# EAGLE design GamePad (EAGLE 9.2.2)
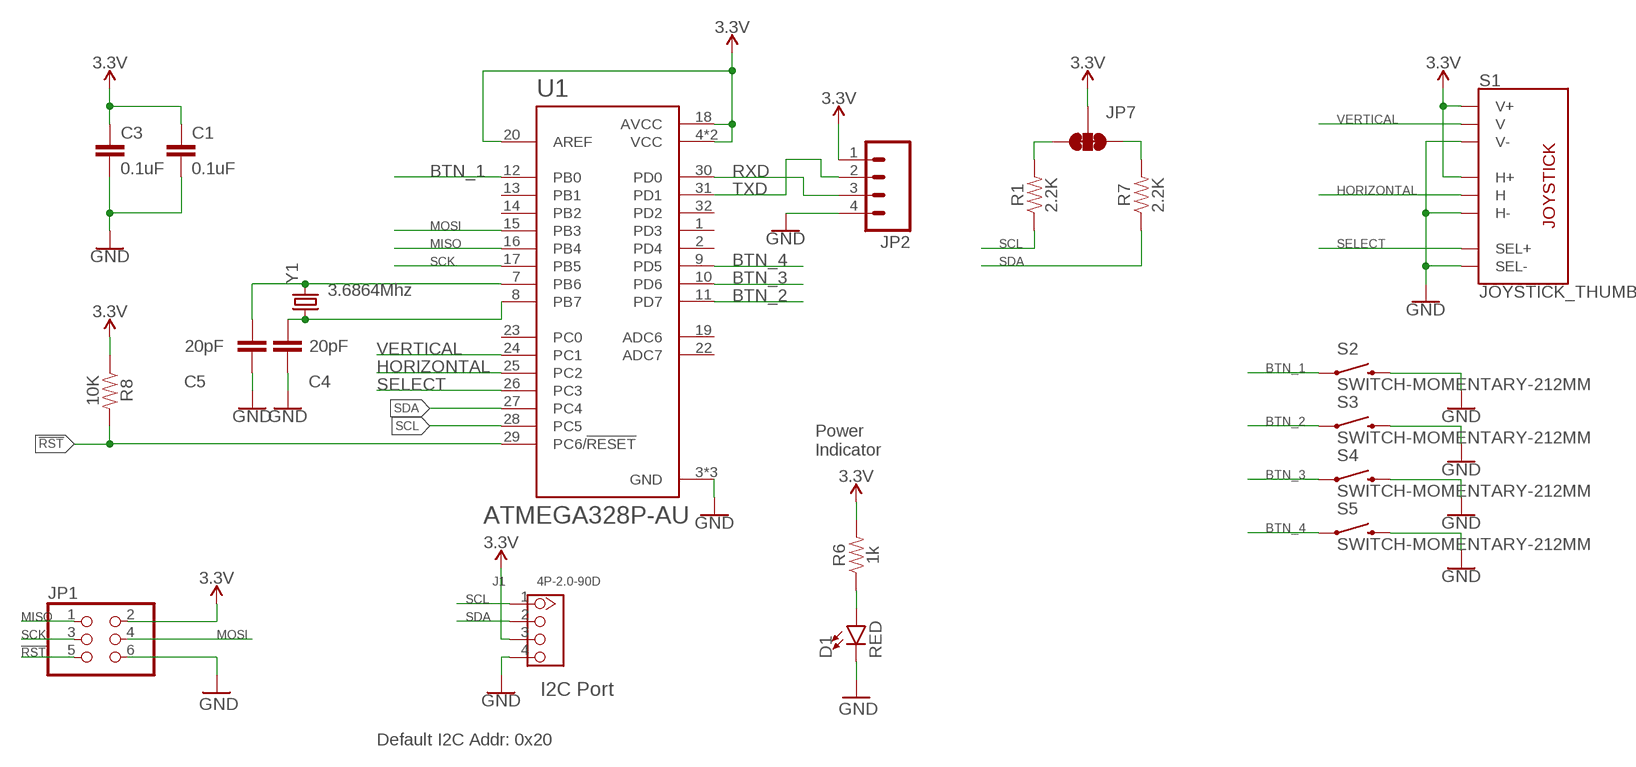
[diagram p0: schematic, sheet 1]

## Parts
C1  0.1uF  CAP0603-CAP  [0603-CAP]
C3  0.1uF  CAP0603-CAP  [0603-CAP]
C4  20pF  CAP0603-CAP  [0603-CAP]
C5  20pF  CAP0603-CAP  [0603-CAP]
D1  RED  LED-RED0603  [LED-0603]
J1  4P-2.0-90D  GROVE-CONNECTOR-DIP-90D(4P-2.0)  [HW4-2.0-90D]
JP1  PINHD-2X3  [2X03]
JP2  M04LOCK  [1X04_LOCK]
JP7  JUMPER-SMT_3_2-NC_TRACE_NO-SILK  [SMT-JUMPER_3_2-NC_TRACE_NO-SILK]
R1  2.2K  4.7KOHM-0603-1/10W-1%  [0603]
R6  1k  1KOHM-0603-1/10W-1%  [0603]
R7  2.2K  4.7KOHM-0603-1/10W-1%  [0603]
R8  10K  330OHM-0603-1/10W-1%  [0603]
S1  JOYSTICK_THUMB  [JOYSTICK]
S2  SWITCH-MOMENTARY-212MM  [TACTILE-PTH-12MM]
S3  SWITCH-MOMENTARY-212MM  [TACTILE-PTH-12MM]
S4  SWITCH-MOMENTARY-212MM  [TACTILE-PTH-12MM]
S5  SWITCH-MOMENTARY-212MM  [TACTILE-PTH-12MM]
U1  ATMEGA328P-AU  [QFP80P900X900X120-32N]
Y1  3.6864Mhz  CRYSTALSMD  [HC49UP]

## Nets
3.3V: C1.1 C3.1 J1.3 JP1.2 JP2.1 JP7.2 R6.2 R8.1 S1.H1(H+) S1.V1(V+) U1.4(VCC) U1.6(VCC) U1.18(AVCC) U1.20(AREF)
!RST: JP1.5 R8.2 U1.29(PC6/!RESET)
BTN_1: S2.1 U1.12(PB0)
BTN_2: S3.1 U1.11(PD7)
BTN_3: S4.1 U1.10(PD6)
BTN_4: S5.1 U1.9(PD5)
GND: C1.2 C3.2 C4.1 C5.1 D1.C J1.4 JP1.6 JP2.4 S1.B2A(SEL-) S1.H3(H-) S1.V3(V-) S2.3 S3.3 S4.3 S5.3 U1.3(GND) U1.5(GND) U1.21(GND)
HORIZONTAL: S1.H2(H) U1.25(PC2)
MISO: JP1.1 U1.16(PB4)
MOSI: JP1.4 U1.15(PB3)
N$1: D1.A R6.1
N$2: JP7.1 R7.2
N$3: JP7.3 R1.2
N$4: C5.2 U1.7(PB6) Y1.2
N$5: C4.2 U1.8(PB7) Y1.1
RXD: JP2.3 U1.30(PD0)
SCK: JP1.3 U1.17(PB5)
SCL: J1.1 R1.1 U1.28(PC5)
SDA: J1.2 R7.1 U1.27(PC4)
SELECT: S1.B1A(SEL+) U1.26(PC3)
TXD: JP2.2 U1.31(PD1)
VERTICAL: S1.V2(V) U1.24(PC1)
Unconnected: U1.1(PD3) U1.2(PD4) U1.13(PB1) U1.14(PB2) U1.19(ADC6) U1.22(ADC7) U1.23(PC0) U1.32(PD2)

## Notes on the sheet
- Power
  Indicator
- I2C Port
- Default I2C Addr: 0x20

## Library data of the parts
C1 C3-C5 = SparkFun:CAP: Capacitor Standard 0603 ceramic capacitor, and 0.1" leaded capacitor.
D1 = SparkFun-LED:LED-RED: Red SMD LED Used in manufacturing of most products at SparkFun Packages: 0603 - SMD 0603 package [Product Link] <http://docs.avagotech.com/docs/AV02-0551EN> 0603 SMART - SMD 0603 SMART package ( more efficient and expensive)[Product Link] <http://www.osram-os.com/Graphics/XPic2/00077099_0.pdf> 1206 - SMD1206 package [Product Link] <https://www.sparkfun.com/datasheets/DevTools/LilyPad/Q150OVS4.pdff> SparkFun Products: Pro Mini 328 -5V <https://www.sparkfun.com/products/821> RedBoard <https://www.sparkfun.com/products/12757> IOIO-OTG <https://www.sparkfun.com/products/13613>; PROD_ID: DIO-00819
J1 = Seeed-Connector -2016:GROVE-CONNECTOR-DIP-90D(4P-2.0): 320110034
JP1 = SparkFun:PINHD-2X3: PIN HEADER
JP2 = SparkFun:M04: Header 4 Standard 4-pin 0.1" header. Use with straight break away headers (SKU : PRT-00116), right angle break away headers (PRT-00553), swiss pins (PRT-00743), machine pins (PRT-00117), and female headers (PRT-00115). Molex polarized connector foot print use with SKU : PRT-08231 with associated crimp pins and housings. 1MM SMD Version SKU: PRT-10208
JP7 = SparkFun-Jumpers:JUMPER-SMT_3_2-NC_TRACE: Normally closed trace jumper (2 of 2 connections) This jumper has a trace between all three pads so they are normally closed (NC). Use a razor knife to open the connection(s). For best results follow the IPC guidelines for cutting traces: Cutout at least 0.063 mm (0.005 in). Remove all loose material to clean up the cut area. Seal the cut with an approved epoxy. Reapply solder to reclose the connection(s).
R1 R7 = SparkFun-Resistors:4.7KOHM: 4.7kΩ resistor A resistor is a passive two-terminal electrical component that implements electrical resistance as a circuit element. Resistors act to reduce current flow, and, at the same time, act to lower voltage levels within circuits. - Wikipedia; PROD_ID: RES-07857; VALUE: 4.7k
R6 = SparkFun-Resistors:1KOHM: 1kΩ resistor A resistor is a passive two-terminal electrical component that implements electrical resistance as a circuit element. Resistors act to reduce current flow, and, at the same time, act to lower voltage levels within circuits. - Wikipedia; PROD_ID: RES-07856
R8 = SparkFun-Resistors:330OHM: 330Ω resistor A resistor is a passive two-terminal electrical component that implements electrical resistance as a circuit element. Resistors act to reduce current flow, and, at the same time, act to lower voltage levels within circuits. - Wikipedia; PROD_ID: RES-00818; VALUE: 330
S1 = SparkFun-Switches:JOYSTICK_THUMB: Analog Thumb Joystick This is a joystick very similar to the ‘analog’ joysticks on PS2 (PlayStation 2) controllers. Directional movements are simply two potentiometers - one for each axis. Pots are ~10k each. This joystick also has a select button that is actuated when the joystick is pressed down. SparkFun Products Thumb Joystick <https://www.sparkfun.com/products/9032> (COM-09032) SparkFun Thumb Joystick Breakout <https://www.sparkfun.com/products/9110> (BOB-09110) SparkFun Joystick Shield Kit <https://www.sparkfun.com/products/9760> (DEV-09760); PROD_ID: COMP-09744; SF_SKU: COM-09032
S2-S5 = SparkFun:SWITCH-MOMENTARY-2
U1 = ATMEGA328P-AU:ATMEGA328P-AU: ATmega Series 20 MHz 32 KB Flash 2 KB SRAM 8-Bit Microcontroller - TQFP-32; AVAILABILITY: Unavailable; DESCRIPTION: Microcontroller Mcu, 8 Bit, Atmega, 20mhz, Tqfp-32; MF: Microchip; MP: ATMEGA328P-AU; PACKAGE: TQFP-32 Microchip; PRICE: None
Y1 = SparkFun:CRYSTAL: Crystals Various standard crystals. Proven footprints. Spark Fun Electronics SKU : COM-00534

## Board
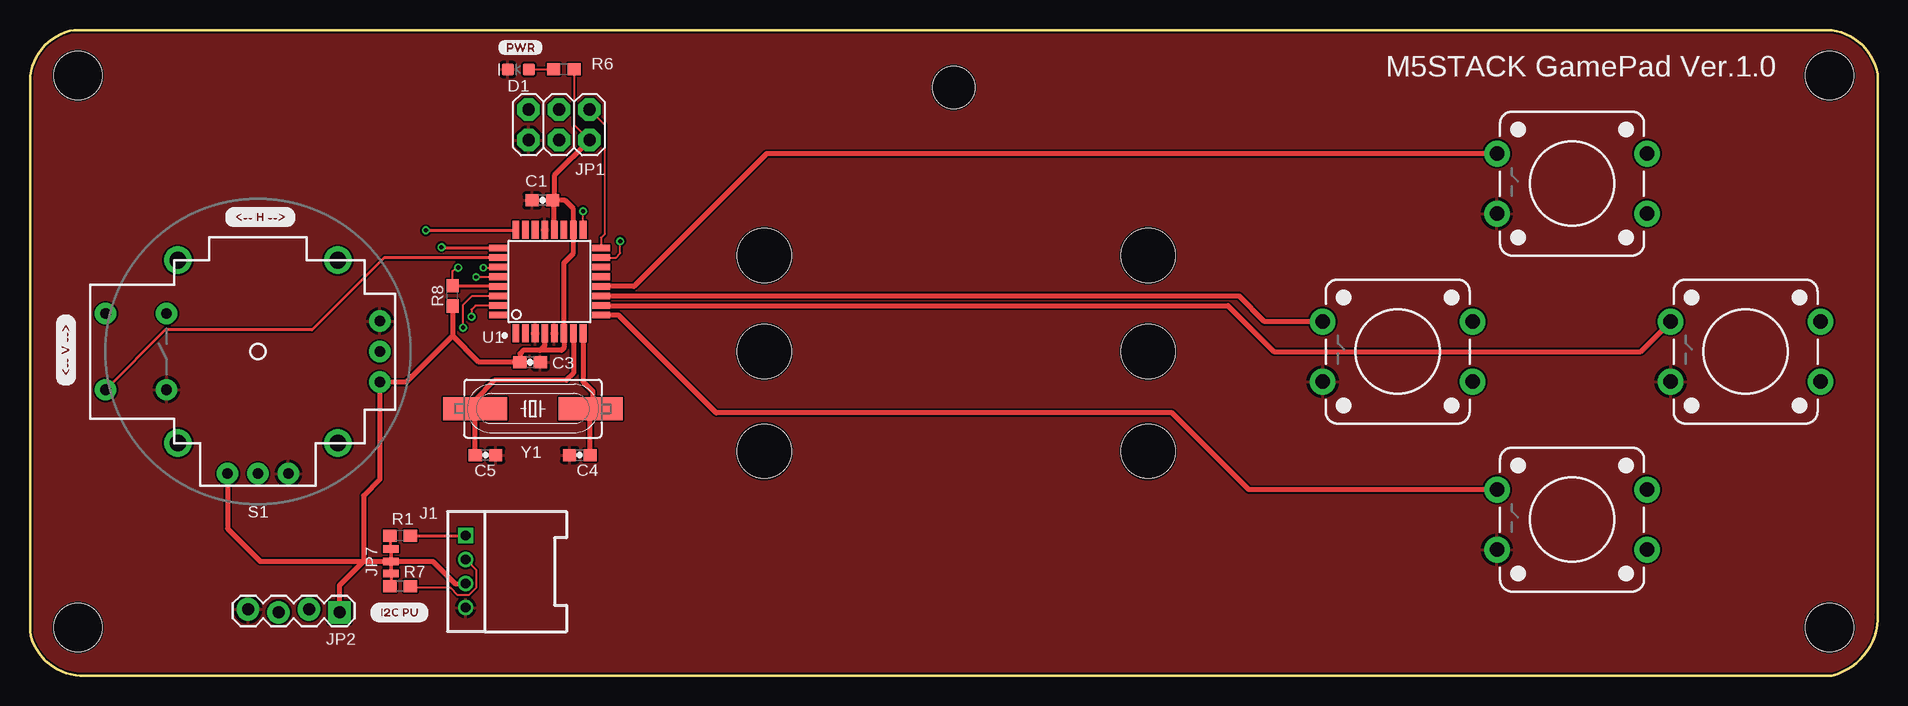
[diagram p1: board, top side]
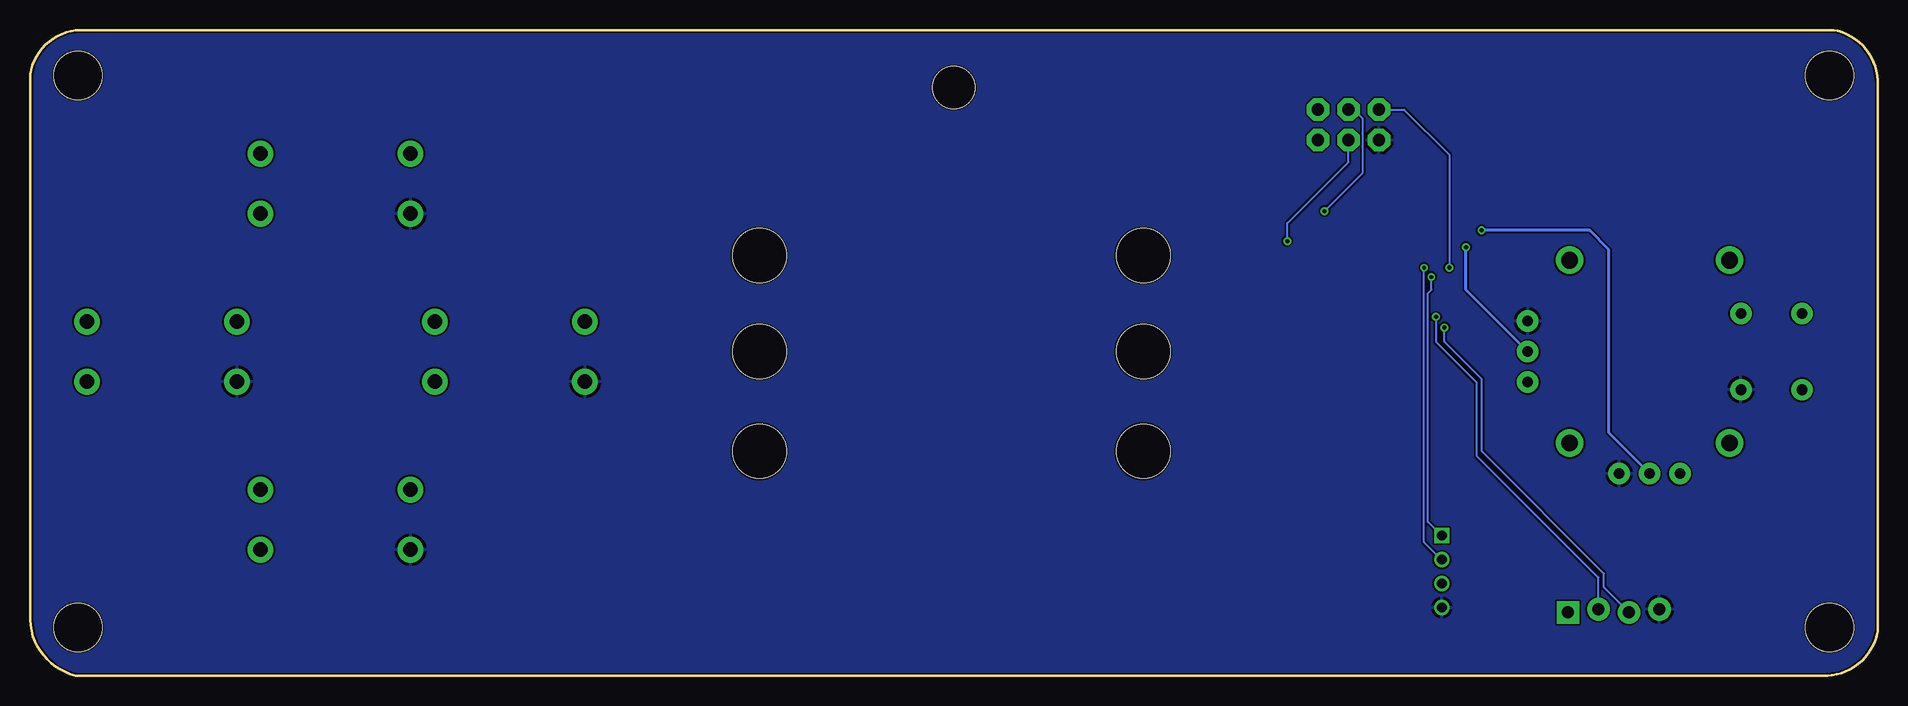
[diagram p2: board, bottom side, seen from below]

Size 154 x 53.8 mm. Coordinates in mm from the lower left corner, seen from the top.
Outline: 0,49.6 0,3.7 arc79 4.2,0 150.2,0 arc79 154,5.1 154,50.1 arc79 149.8,53.8 3.7,53.8 arc79 0,49.6
Copper layers (1*16): Top 0.035mm / dielectric 1.5mm / Bottom 0.035mm
Design rules "SparkFun-2-layer-PCBWay-LIMIT": minimum track width 6mil, minimum drill 0.3mm, track to track 6mil, track to pad 6mil, pad to pad 6mil, via to via 6mil, smd to smd 6mil, copper to edge 6mil, drill to drill 6mil, minimum pad ring 6mil, minimum via ring 6mil, stop-mask expansion 4mil, vias tented up to drill 25mil, thermal gap 10mil
Holes 4.5 mm at 61.2,35 61.2,27 61.2,18.7 93.2,35 93.2,27 93.2,18.7
Holes 4 mm at 4,50 4,4 150,50 150,4
Holes 3.5 mm at 77,49

### Footprints (pad centres in the part's own frame; a part is rotated, then mirrored left to right if it is on the bottom)
0603-CAP = smd 1.1 x 1: 1 -0.85,0; 2 0.85,0
LED-0603 = smd 1 x 1: A -0.877,0; C 0.877,0
HW4-2.0-90D = drill 0.8 pad 1.27 square: 1 -3,0 | drill 0.8 pad 1.27: 2 -1,0; 3 1,0; 4 3,0
2X03 = drill 1.016 pad 1.88 octagon: 1 -2.54,-1.27; 2 -2.54,1.27; 3 0,-1.27; 4 0,1.27; 5 2.54,-1.27; 6 2.54,1.27
1X04_LOCK = drill 1.016 pad 1.88 square: 1 0,0.127 | drill 1.016 pad 1.88: 2 2.54,-0.127; 3 5.08,0.127; 4 7.62,-0.127
SMT-JUMPER_3_2-NC_TRACE_NO-SILK = smd 0.635 x 1.27: 1 -1.016,0; 2 0,0; 3 1.016,0
0603 = smd 1.1 x 1: 1 -0.85,0; 2 0.85,0
JOYSTICK = drill 0.9 pad 1.778: B1A -3.175,12.7; B1B 3.175,12.7; B2A -3.175,7.62; B2B 3.175,7.62 | drill 0.889 pad 1.778: H1 -2.54,-10.16; H2 0,-10.16; H3 2.54,-10.16; V1 -10.16,2.54; V2 -10.16,0; V3 -10.16,-2.54 | drill 1.397 pad 2.286: MOUNT1 -7.62,6.668; MOUNT2 -7.62,-6.668; MOUNT3 7.62,-6.668; MOUNT4 7.62,6.668
TACTILE-PTH-12MM = drill 1.2 pad 2.159: 1 6.25,-2.5; 2 -6.25,-2.5; 3 6.25,2.5; 4 -6.25,2.5
QFP80P900X900X120-32N = smd 1.5 x 0.55: 1 -4.3,2.8; 2 -4.3,2; 3 -4.3,1.2; 4 -4.3,0.4; 5 -4.3,-0.4; 6 -4.3,-1.2; 7 -4.3,-2; 8 -4.3,-2.8; 17 4.3,-2.8; 18 4.3,-2; 19 4.3,-1.2; 20 4.3,-0.4; 21 4.3,0.4; 22 4.3,1.2; 23 4.3,2; 24 4.3,2.8 | smd 0.55 x 1.5: 9 -2.8,-4.3; 10 -2,-4.3; 11 -1.2,-4.3; 12 -0.4,-4.3; 13 0.4,-4.3; 14 1.2,-4.3; 15 2,-4.3; 16 2.8,-4.3; 25 2.8,4.3; 26 2,4.3; 27 1.2,4.3; 28 0.4,4.3; 29 -0.4,4.3; 30 -1.2,4.3; 31 -2,4.3; 32 -2.8,4.3
HC49UP = smd 5.334 x 1.93: 1 -4.826,0; 2 4.826,0

### Placement (x,y rotation side)
C1  42.71,39.61 180 top
C3  41.69,26.12 0 top
C4  45.83,18.38 0 top
C5  37.97,18.38 180 top
D1  40.7,50.51 180 top
J1  36.31,8.67 270 top
JP1  44.1,45.9 180 top
JP2  25.8,5.4 180 top
JP7  30.09,9.52 90 top
R1  30.85,11.65 180 top
R6  44.5,50.55 0 top
R7  30.85,7.45 180 top
R8  35.21,31.65 90 top
S1  19,27 90 top
S2  128.54,41 180 top
S3  114,27 180 top
S4  143,27 180 top
S5  128.54,13 180 top
U1  43.3,32.84 90 top
U$4  [I2C_PU0]  28.33,5.25 0 top
U$7  [###_V_###0]  2.99,24.1 90 top
U$14  [PWR-()-03]  39.01,52.34 0 top
U$15  [###_H_###1]  16.21,38.21 0 top
Y1  41.91,22.24 180 top

### Tracks (layer width: path | path; a pad name or v marks a point on that pad's centre or on a via)
3.3V
  Top 0.152: R6.2 45.35,45.92 JP1.2
  Top 0.406: J1.3 35.43,7.67 33.58,9.52 JP7.2 27.8,9.52 | S1.V1 16.46,12.24 19.18,9.52 27.8,9.52 | 27.8,9.52 27.8,15 29.16,16.36 S1.H1 31.36,24.46 35.21,28.31 | R8.1 35.21,28.31 | 35.21,28.31 37.4,26.12 C3.1 40.84,26.84 41.1,27.1 42.5,27.1 | U1.4 42.9,27.5 42.5,27.1 | 42.5,27.1 44.3,27.1 44.5,27.3 U1.6 44.5,34.4 45.3,35.2 U1.18 45.3,38.9 44.6,39.6 43.7,39.6 | JP2.1 25.8,7.52 27.8,9.52 | U1.20 43.7,39.47 C1.1 43.7,39.6 | JP1.2 43.7,41.69 43.7,39.6
  Bottom 0.152: 29.26,24.54 S1.H1
!RST  (via drill 0.35)
  Top 0.152: 39.62,32.46 39.01,32.46 U1.29 | R8.2 35.21,33.71 35.5,34 v35.7,34
  Top 0.254: U1.29 35.27,32.44 R8.2
  Bottom 0.152: v35.7,34 35.7,43.41 39.46,47.17 JP1.5
BTN_1
  Top 0.406: S2.1 61.4,43.5 50.34,32.44 U1.12
BTN_2
  Top 0.406: S3.1 102.9,29.5 100.76,31.64 U1.11
BTN_3
  Top 0.406: U1.10 99.86,30.84 103.7,27 134.25,27 S4.1
BTN_4
  Top 0.406: S5.1 101.6,15.5 95.2,21.9 57.2,21.9 49.06,30.04 U1.9
GND
  pour Top: 0,0 154,0 154,54.1 0,54.1
  pour Bottom: 0.1,-0.1 154.1,-0.1 154.1,54 0.1,54
HORIZONTAL  (via drill 0.35)
  Top 0.254: v34.3,35.7 34.36,35.64 U1.25
  Bottom 0.254: v34.3,35.7 34.3,32.14 S1.H2
MISO
  Top 0.152: JP1.1 47.9,45.91 47.9,36.8 47.6,36.5 U1.16
MOSI  (via drill 0.35)
  Top 0.152: U1.15 48.84,34.84 49.2,35.2 v49.2,36.2
  Bottom 0.152: v49.2,36.2 49.2,37.7 44.1,42.8 JP1.4
N$1
  Top 0.152: 41.6,50.53 D1.A 43.61,50.51 R6.1
N$2
  Top 0.254: JP7.1 30.09,7.54 R7.2
N$3
  Top 0.254: R1.2 30,10.63 JP7.3
N$4
  Top 0.406: C5.2 37.08,18.42 Y1.2 37.08,22.98 38.7,24.6 44.7,24.6 45.3,25.2 U1.7
N$5
  Top 0.406: U1.8 46.1,24.5 46.9,23.7 46.9,22.4 Y1.1 46.68,22.18 C4.2
RXD  (via drill 0.35)
  Top 0.152: v36.1,29 36.1,30.9 36.84,31.64 U1.30
  Bottom 0.152: JP2.3 22.8,7.35 22.8,8.5 33,18.7 33,24.7 36.1,27.8 v36.1,29
SCK  (via drill 0.35)
  Top 0.152: U1.17 v46.1,38.7
  Bottom 0.152: v46.1,38.7 42.9,41.9 42.9,46.4 43.67,47.17 JP1.3
SCL  (via drill 0.3)
  Top 0.152: v37.19,33.22 38.86,33.22 U1.28
  Top 0.254: R1.1 36.29,11.65 J1.1
  Bottom 0.152: v37.19,33.22 37.19,32.16 37.49,31.85 37.49,12.8 36.42,11.73 J1.1
SDA  (via drill 0.3)
  Top 0.152: R7.1 31.85,7.32 35.05,7.32 35.66,6.71 36.58,6.71 37.19,7.32 37.19,8.84 36.42,9.6 J1.2 | v37.8,33.98 38.86,33.98 U1.27
  Bottom 0.152: v37.8,33.98 37.8,11.12 36.42,9.75 J1.2
SELECT
  Top 0.254: U1.26 29.54,34.84 23.5,28.8 11.28,28.8 S1.B1A
TXD  (via drill 0.35)
  Top 0.152: U1.31 37.14,30.84 36.8,30.5 v36.8,29.9
  Bottom 0.152: v36.8,29.9 36.8,27.8 33.4,24.4 33.4,18.3 23.26,8.16 JP2.2
VERTICAL  (via drill 0.35)
  Top 0.254: v33,37.1 40.46,37.1 U1.24
  Bottom 0.254: S1.V2 22.4,20.24 22.4,35.5 24,37.1 v33,37.1

### Text on the board
tNames: M5STACK GamePad Ver.1.0